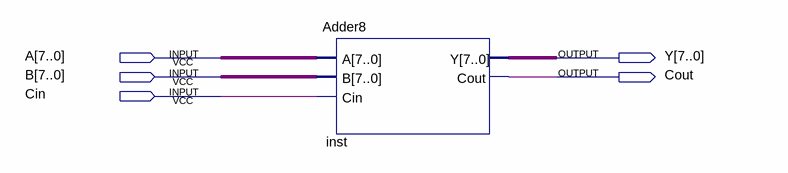
[diagram p0: schematic sheet]
// Quartus schematic adder.bdf as structural Verilog: 1 symbols, 5 pins
module adder (
  input  [7:0] A,
  input  [7:0] B,
  input  Cin,
  output [7:0] Y,
  output Cout
);

  Adder8 inst (.A(A), .B(B), .Cin(Cin), .Y(Y), .Cout(Cout));
endmodule
